# Altium schematic sheet Sheet2.SchDoc
size A; SheetNumber: 1; SheetTotal: 1
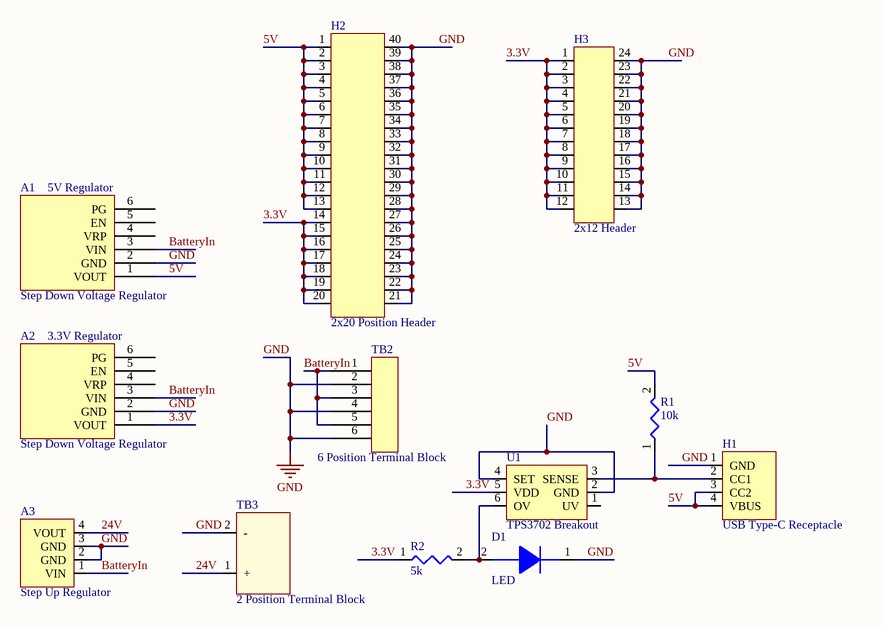
[diagram p0: Sheet2.SchDoc]

## Parts
A1  Step Down Voltage Regulator  [New Volt Reg TEMPLATE]
A2  Step Down Voltage Regulator  [New Volt Reg TEMPLATE]
A3  Step Up Regulator  [24V STEP UP REGULATOR]
D1  LED  [LED]
H1  USB Type-C Receptacle  [USB Type-C Receptacle]
H2  2x20 Position Header  [2x20 Header]
H3  2x12 Header  [2x12 HEADER]
R1  10k  [Resistor]
R2  5k  [Resistor]
TB2  6 Position Terminal Block  [NEW 6 Terminal]
TB3  2 Position Terminal Block  [Terminal Block]
U1  TPS3702 Breakout  [TPS3702 Breakout]

## Nets
GND: A1.2(GND) A2.2(GND) A3.2(GND) A3.3(GND) D1.1(Anode) H1.1(GND) H2.21 H2.22 H2.23 H2.24 H2.25 H2.26 H2.27 H2.28 H2.29 H2.30 H2.31 H2.32 H2.33 H2.34 H2.35 H2.36 H2.37 H2.38 H2.39 H2.40 H3.13 H3.14 H3.15 H3.16 H3.17 H3.18 H3.19 H3.20 H3.21 H3.22 H3.23 H3.24 TB2.2 TB2.4 TB2.6 TB3.2(-) U1.2(GND) U1.4(SET)
3.3V: A2.1(VOUT) H2.14 H2.15 H2.16 H2.17 H2.18 H2.19 H2.20 H3.1 H3.2 H3.3 H3.4 H3.5 H3.6 H3.7 H3.8 H3.9 H3.10 H3.11 H3.12 R2.1 U1.5(VDD)
5V: A1.1(VOUT) H1.3(CC2) H1.4(VBUS) H2.1 H2.2 H2.3 H2.4 H2.5 H2.6 H2.7 H2.8 H2.9 H2.10 H2.11 H2.12 H2.13 R1.2
24V: A3.4(VOUT) TB3.1(+)
BatteryIn: A1.3(VIN) A2.3(VIN) A3.1(VIN) TB2.1 TB2.3 TB2.5
NetD1_2: D1.2(Cath) R2.2 U1.6(OV)
NetH1_2: H1.2(CC1) R1.1 U1.3(SENSE)

Not connected (* = marked no-connect by the designer): A1 4(VRP) 5(EN) 6(PG); A2 4(VRP) 5(EN) 6(PG); U1 1(UV)

## Notes on the sheet
- (near A1) 5V Regulator
- (near A2) 3.3V Regulator

## Library data of the parts
R1 R2 = Resistor